# Altium schematic sheet Gatedriver_sch_lib.SchDoc
size A4; SheetNumber: 1; SheetTotal: 1; SPICEModelCacheHIDJMLYW: <root> / <DocumentId>HIDJMLYW</DocumentId> / <CacheFrame Number="0"> / <Model Name="diode" Kind="MDL"> / <Text>*Default Diode / *Diode Pinout: A,K / .MODEL DIODE D()</Text> / </Model> / </CacheFrame> / </root>
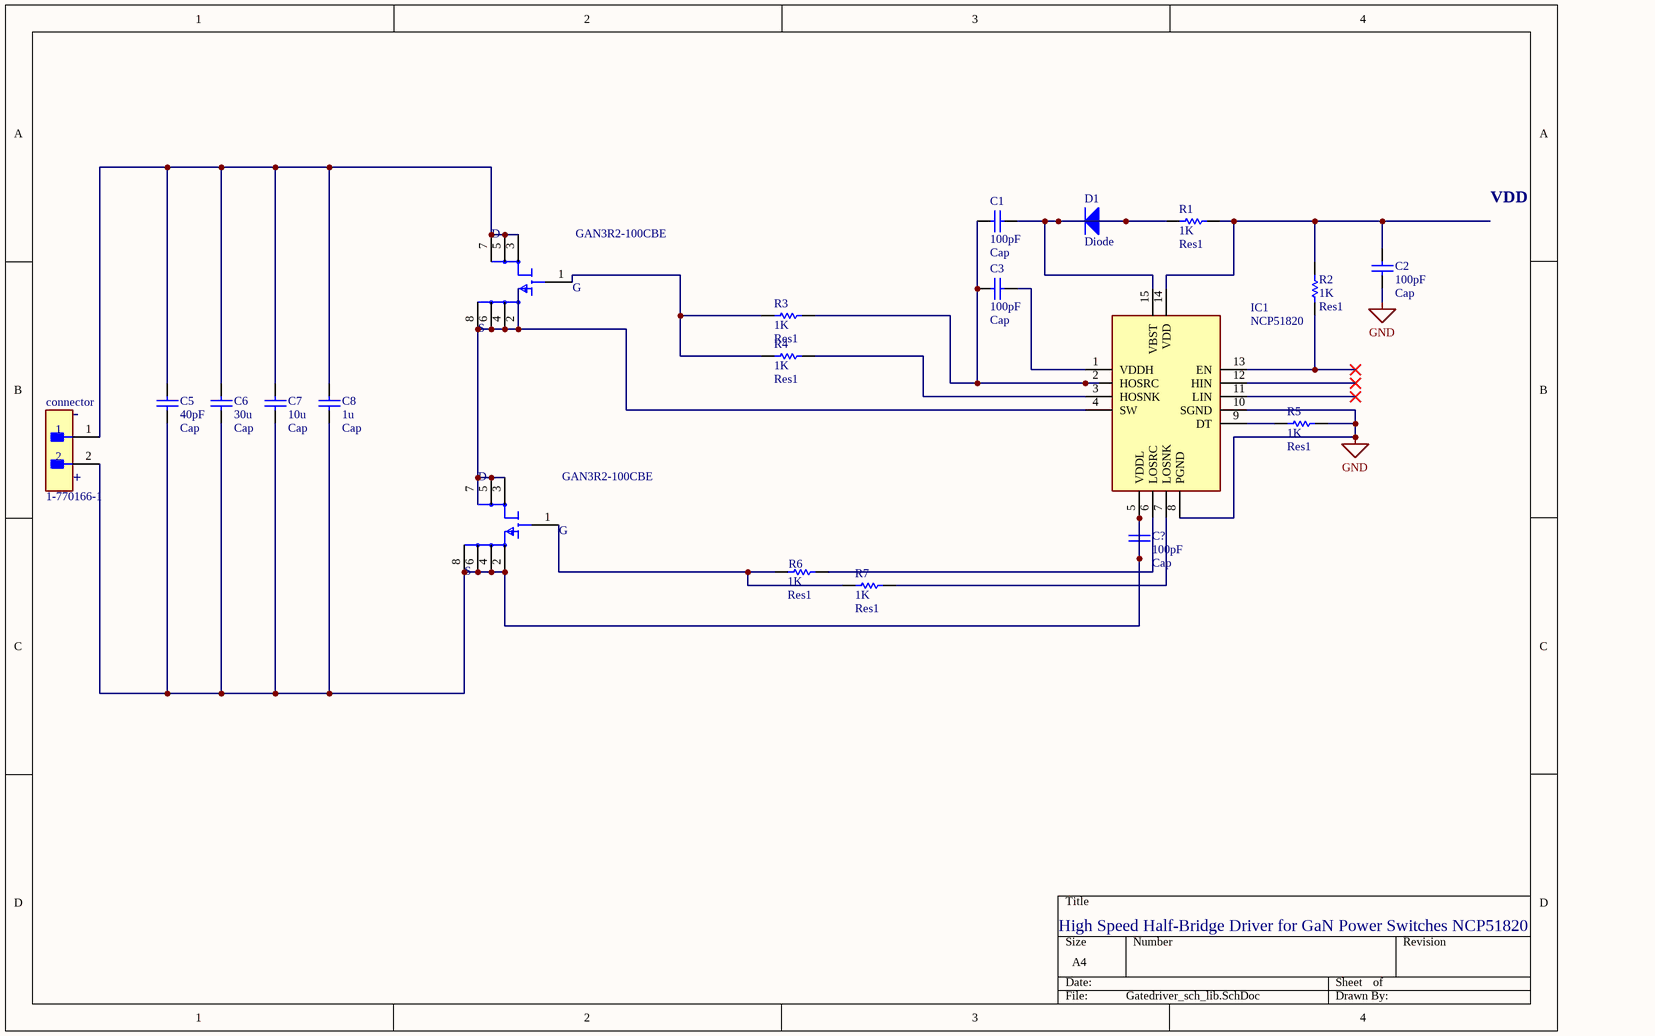
[diagram p0: Gatedriver_sch_lib.SchDoc]

## Parts
1  GAN3R2-100CBE  [FP-WLCSP8-SOT8072-MFG]
2  GAN3R2-100CBE  [FP-WLCSP8-SOT8072-MFG]
C1  Cap  value 100pF  [RAD-0.3]
C2  Cap  value 100pF  [RAD-0.3]
C3  Cap  value 100pF  [RAD-0.3]
C5  Cap  value 40pF  [RAD-0.3]
C6  Cap  value 30u  [RAD-0.3]
C7  Cap  value 10u  [RAD-0.3]
C8  Cap  value 1u  [RAD-0.3]
C?  Cap  value 100pF  [RAD-0.3]
connector  1-770166-1  [FP-1-770166-1-MFG]
D1  Diode  [SMC]
IC1  NCP51820  [NCP51820]
R1  Res1  value 1K  [AXIAL-0.3]
R2  Res1  value 1K  [AXIAL-0.3]
R3  Res1  value 1K  [AXIAL-0.3]
R4  Res1  value 1K  [AXIAL-0.3]
R5  Res1  value 1K  [AXIAL-0.3]
R6  Res1  value 1K  [AXIAL-0.3]
R7  Res1  value 1K  [AXIAL-0.3]

## Nets
GND: C2.1 IC1.8(PGND) IC1.10(SGND) R5.2
Net1_1: 1.1(G) R3.1 R4.1
Net1_2: 1.2(S) 1.4(S) 1.6(S) 1.8(S) 2.3(D) 2.5(D) 2.7(D) IC1.4(SW)
Net1_3: 1.3(D) 1.5(D) 1.7(D) C5.2 C6.2 C7.2 C8.2 connector.1
Net2_1: 2.1(G) R6.1 R7.1
Net2_2: 2.2(S) 2.4(S) 2.6(S) 2.8(S) C5.1 C6.1 C7.1 C8.1 C?.1 C?.2 connector.2 IC1.5(VDDL)
NetC1_1: C1.1 C3.1 IC1.2(HOSRC) R3.2
NetC1_2: C1.2 D1.1(A) D1.2(K) IC1.15(VBST) R1.1
NetC2_2: C2.2 IC1.14(VDD) R1.2 R2.2
NetC3_2: C3.2 IC1.1(VDDH)
NetIC1_3: IC1.3(HOSNK) R4.2
NetIC1_6: IC1.6(LOSRC) R6.2
NetIC1_7: IC1.7(LOSNK) R7.2
NetIC1_9: IC1.9(DT) R5.1
NetIC1_13: IC1.13(EN) R2.1

Not connected (* = marked no-connect by the designer): IC1 11(LIN)* 12(HIN)*

## Notes on the sheet
- VDD
- (near connector) -
- (near connector) +
- High Speed Half-Bridge Driver for GaN Power Switches NCP51820

## Library data of the parts
1 2 = GAN3R2-100CBE_1: GAN3R2-100CBE                                                                                                                                                                                                                                                     100 V, 3.2 mOhm Gallium Nitride (GaN) FET in a 3.5 mm x 2.13 mm Wafer Level Chip; NexarPartId: 136220986; Drain to Source Resistance: 2.4mΩ; Power Dissipation: 394W; Number of Channels: 1; Drain to Source Voltage (Vdss): 100V; Gate to Source Voltage (Vgs): -4V; Max Junction Temperature (Tj): 150°C; Continuous Drain Current (ID): 60A; Height: 464µm; Max Operating Temperature: 150°C; Min Operating Temperature: -40°C; Drain to Source Breakdown Voltage: 100V; MPN: GAN3R2-100CBE
C1-C3 C5-C8 C? = Cap: Capacitor; Published: 8-Jun-2000; LatestRevisionDate: 17-Jul-2002; LatestRevisionNote: Re-released for DXP Platform.; PackageReference: RAD-0.3; Publisher: Altium Limited; PackageDescription: Radial Cap, Thru-Hole; 2 Leads; 0.3 in Pin Spacing
connector = CMP-03369-000027-1: CONN HEADER VERT 2POS 4.14MM; Manufacturer: TE Connectivity; Number Of Contacts: 2; Standoff Height: 0.63mm; Conn Gender: Male; Conn Orientation: Vertical; Is Female: yes; Voltage Rating: 600V; Current Rating: 9.5A; ComponentLink2Description: Datasheet; Number Of Rows: 1; Device Class L1: Connectors; Package: 1-770166-1; RoHS: TRUE; Device Class L3: unset; Temperature: -55°C to +105°C; Device Class L2: Headers and Wire Housings; Temperature Range High: +105°C; Contact Material: Gold,Nickel; Automotive: No; Pitch: 4.14mm; Manufacturer Part Number: 1-770166-1; ComponentLink2URL: https://www.te.com/commerce/DocumentDelivery/DDEController?Action=showdoc&DocId=Customer+Drawing%7F770166%7FM%7Fpdf%7FEnglish%7FENG_CD_770166_M.pdf%7F1-770166-1; Mouser Description: Mini-Universal MATE-N-LOK 2 Position Single Row Through-Hole Straight Pin Header; Category: Conn; Temperature Range Low: -55°C; Octopart: https://octopart.com/1-770166-1-te+connectivity-46507887; Digikey Description: CONN HEADER VERT 2POS 4.14MM; Lead Free: Yes; Height: 14.51mm
D1 = Diode: Default Diode; Published: 8-Jun-2000; LatestRevisionDate: 17-Jul-2002; LatestRevisionNote: Re-released for DXP Platform.; PackageVersion: Sep-1996; PackageReference: SMC; Publisher: Altium Limited; PackageDescription: DO-214-AB/SMC; 2 C-Bend Leads; Body 7.9 x 5.9 mm, inc. leads (LxW); Code_JEDEC: DO-214-AB
IC1 = NCP51820: Integrated Circuit; Manufacturer_Name: onsemi; Datasheet Link: https://www.onsemi.com/download/data-sheet/pdf/ncp51820-d.pdf; Height: 0.9mm; Manufacturer_Part_Number: NCP51820; Mouser Part Number: N/A; Mouser Price/Stock: https://www.mouser.co.uk/ProductDetail/onsemi/NCP51820?qs=vEM7xhTegWhaPMdkL3AwCA%3D%3D
R1-R7 = Res1: Resistor; Published: 8-Jun-2000; LatestRevisionDate: 17-Jul-2002; LatestRevisionNote: Re-released for DXP Platform.; PackageReference: AXIAL-0.3; Publisher: Altium Limited; PackageDescription: Axial Device, Thru-Hole; 2 Leads; 0.3 in Pin Spacing